# Altium schematic sheet RP2350A.SchDoc
size B; SheetNumber: 1; SheetTotal: 2
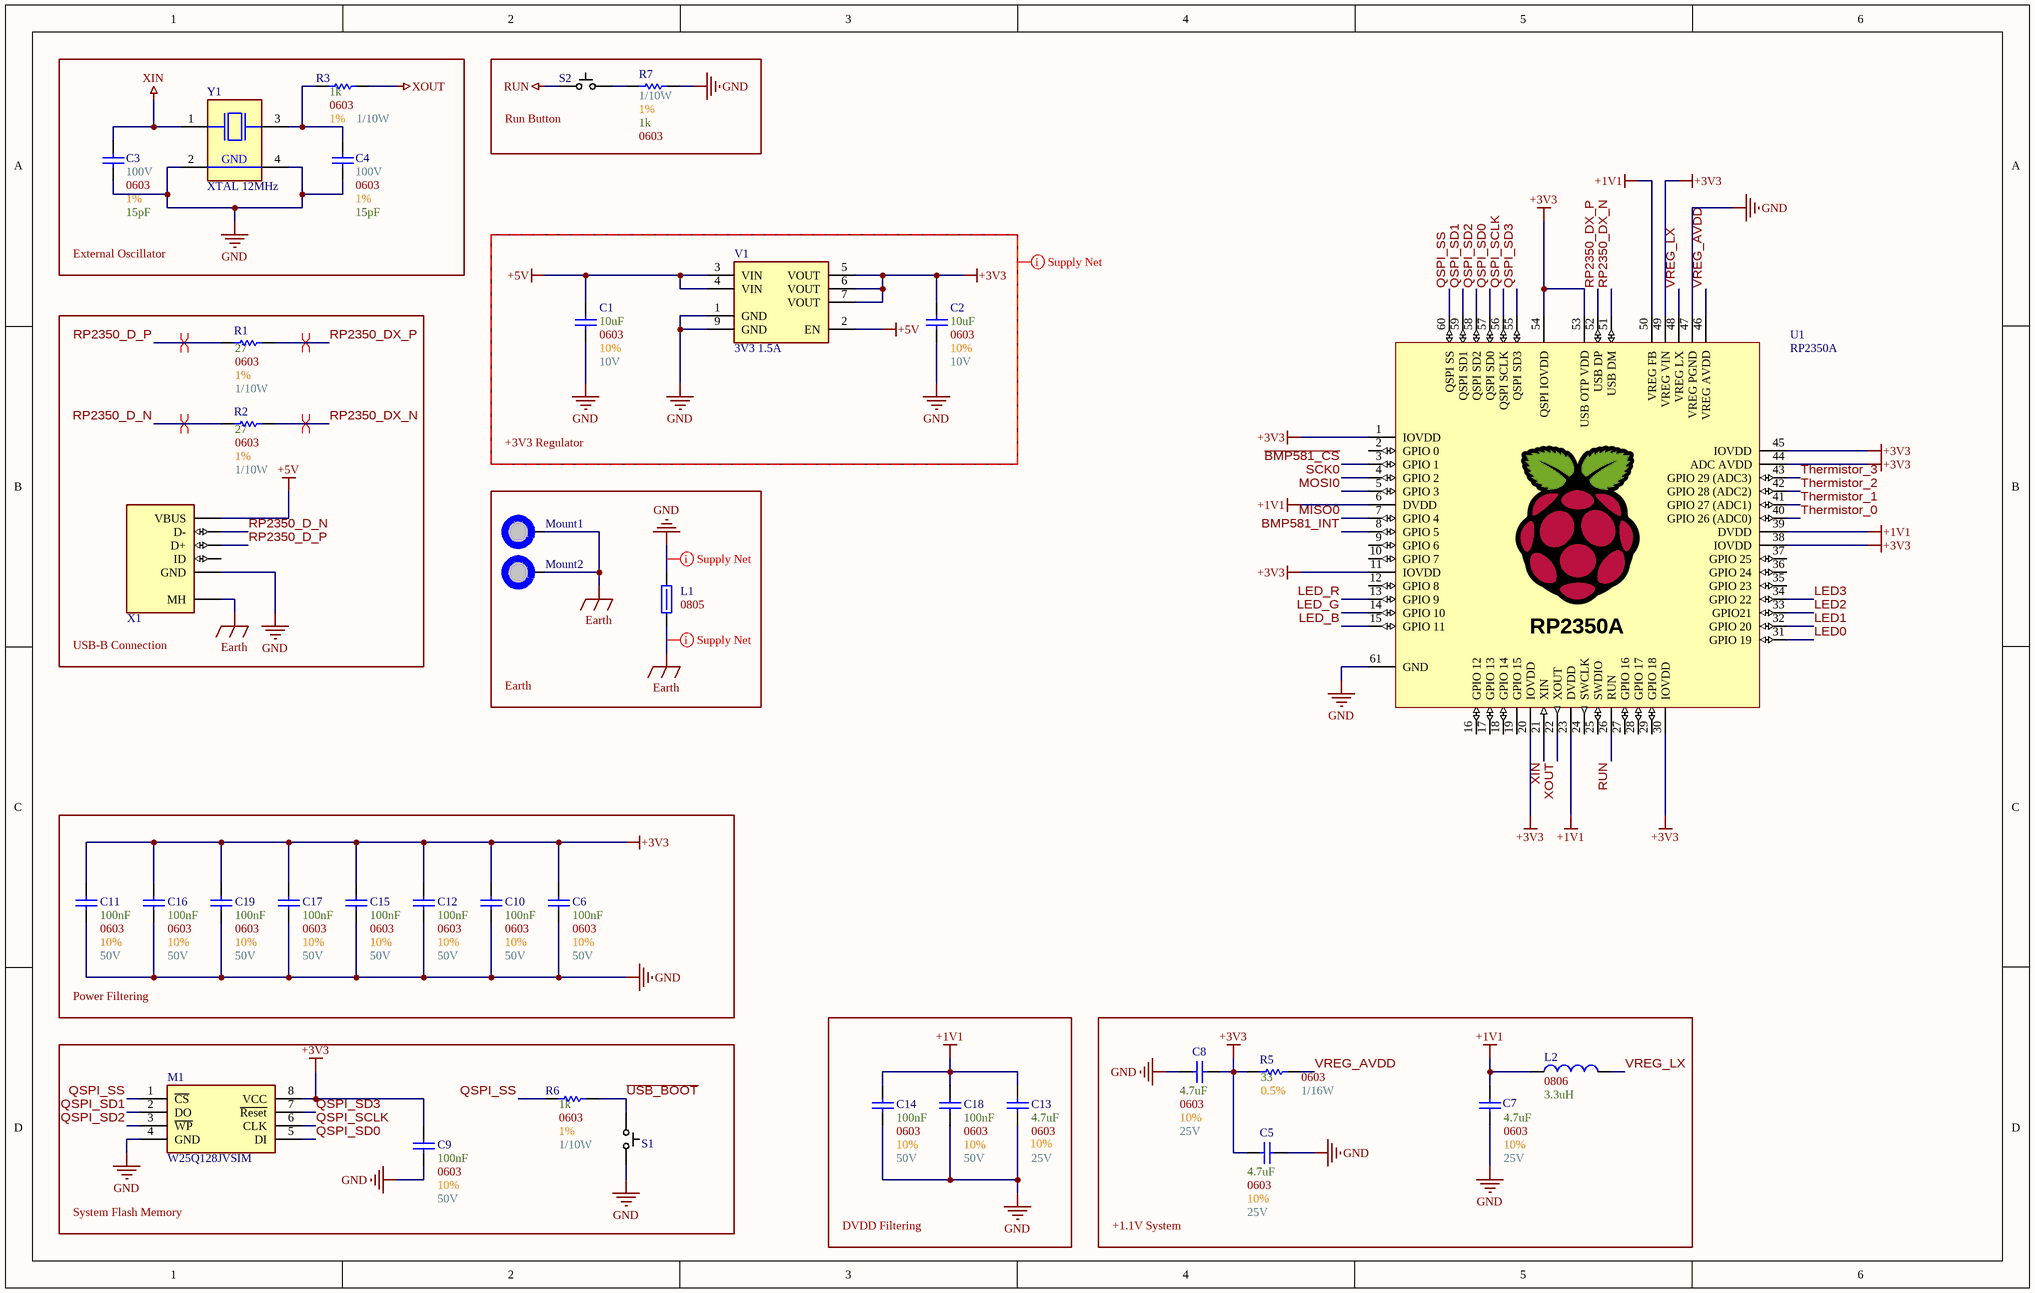
[diagram p0: RP2350A.SchDoc]

## Parts
C1  Max Voltage: 10V  Size Package: 0603  Tolerance: 10%  Capacitance: 10uF  [[Cap] SMD 0603]  (hidden comment: [Cap] 0603 10uF 10% 10V)
C2  Max Voltage: 10V  Size Package: 0603  Tolerance: 10%  Capacitance: 10uF  [[Cap] SMD 0603]  (hidden comment: [Cap] 0603 10uF 10% 10V)
C3  Max Voltage: 100V  Size Package: 0603  Tolerance: 1%  Capacitance: 15pF  [[Cap] SMD 0603]  (hidden comment: [Cap] 0603 15pF 1% 100V)
C4  Max Voltage: 100V  Size Package: 0603  Tolerance: 1%  Capacitance: 15pF  [[Cap] SMD 0603]  (hidden comment: [Cap] 0603 15pF 1% 100V)
C5  Max Voltage: 25V  Size Package: 0603  Tolerance: 10%  Capacitance: 4.7uF  [[Cap] SMD 0603]  (hidden comment: [Cap] 0603 4.7uF 10% 25V)
C6  Max Voltage: 50V  Size Package: 0603  Tolerance: 10%  Capacitance: 100nF  [[Cap] SMD 0603]  (hidden comment: [Cap] 0603 0.1uF 10% 50V)
C7  Max Voltage: 25V  Size Package: 0603  Tolerance: 10%  Capacitance: 4.7uF  [[Cap] SMD 0603]  (hidden comment: [Cap] 0603 4.7uF 10% 25V)
C8  Max Voltage: 25V  Size Package: 0603  Tolerance: 10%  Capacitance: 4.7uF  [[Cap] SMD 0603]  (hidden comment: [Cap] 0603 4.7uF 10% 25V)
C9  Max Voltage: 50V  Size Package: 0603  Tolerance: 10%  Capacitance: 100nF  [[Cap] SMD 0603]  (hidden comment: [Cap] 0603 0.1uF 10% 50V)
C10  Max Voltage: 50V  Size Package: 0603  Tolerance: 10%  Capacitance: 100nF  [[Cap] SMD 0603]  (hidden comment: [Cap] 0603 0.1uF 10% 50V)
C11  Max Voltage: 50V  Size Package: 0603  Tolerance: 10%  Capacitance: 100nF  [[Cap] SMD 0603]  (hidden comment: [Cap] 0603 0.1uF 10% 50V)
C12  Max Voltage: 50V  Size Package: 0603  Tolerance: 10%  Capacitance: 100nF  [[Cap] SMD 0603]  (hidden comment: [Cap] 0603 0.1uF 10% 50V)
C13  Max Voltage: 25V  Size Package: 0603  Tolerance: 10%  Capacitance: 4.7uF  [[Cap] SMD 0603]  (hidden comment: [Cap] 0603 4.7uF 10% 25V)
C14  Max Voltage: 50V  Size Package: 0603  Tolerance: 10%  Capacitance: 100nF  [[Cap] SMD 0603]  (hidden comment: [Cap] 0603 0.1uF 10% 50V)
C15  Max Voltage: 50V  Size Package: 0603  Tolerance: 10%  Capacitance: 100nF  [[Cap] SMD 0603]  (hidden comment: [Cap] 0603 0.1uF 10% 50V)
C16  Max Voltage: 50V  Size Package: 0603  Tolerance: 10%  Capacitance: 100nF  [[Cap] SMD 0603]  (hidden comment: [Cap] 0603 0.1uF 10% 50V)
C17  Max Voltage: 50V  Size Package: 0603  Tolerance: 10%  Capacitance: 100nF  [[Cap] SMD 0603]  (hidden comment: [Cap] 0603 0.1uF 10% 50V)
C18  Max Voltage: 50V  Size Package: 0603  Tolerance: 10%  Capacitance: 100nF  [[Cap] SMD 0603]  (hidden comment: [Cap] 0603 0.1uF 10% 50V)
C19  Max Voltage: 50V  Size Package: 0603  Tolerance: 10%  Capacitance: 100nF  [[Cap] SMD 0603]  (hidden comment: [Cap] 0603 0.1uF 10% 50V)
L1  Size Package: 0805  [[Ferrite] SMD 0805]  (hidden comment: 652-MH2029-300Y)
L2  Package: 0806  Inductance: 3.3uH  [[Inductor] SMD 0806]  (hidden comment: [3.3uH] SMD 0806 2.1A)
M1  W25Q128JVSIM  [[Flash] 128MBit]
Mount1  M3 Mount Hole  [[Mount] M3 Mount Hole]  (value not drawn)  (no BOM)
Mount2  M3 Mount Hole  [[Mount] M3 Mount Hole]  (value not drawn)  (no BOM)
R1  Wattage: 1/10W  Tolerance: 1%  Resistance: 27  Size Package: 0603  [[Res] SMD 0603]  (hidden comment: [27] SMD 0603 1% 1/10W)
R2  Wattage: 1/10W  Tolerance: 1%  Resistance: 27  Size Package: 0603  [[Res] SMD 0603]  (hidden comment: [27] SMD 0603 1% 1/10W)
R3  Wattage: 1/10W  Tolerance: 1%  Resistance: 1k  Size Package: 0603  [[Res] SMD 0603]  (hidden comment: [1k] SMD 0603 1% 1/10W)
R5  Wattage: 1/16W  Tolerance: 0.5%  Resistance: 33  Size Package: 0603  [[Res] SMD 0603]  (hidden comment: [33] SMD 0603 0.5% 1/16W)
R6  Wattage: 1/10W  Tolerance: 1%  Resistance: 1k  Size Package: 0603  [[Res] SMD 0603]  (hidden comment: [1k] SMD 0603 1% 1/10W)
R7  Wattage: 1/10W  Tolerance: 1%  Resistance: 1k  Size Package: 0603  [[Res] SMD 0603]  (hidden comment: [1k] SMD 0603 1% 1/10W)
S1  [SPST] SMD Pushbutton  [[SPST] SMD Pushbutton]  (value not drawn)
S2  [SPST] SMD Pushbutton  [[SPST] SMD Pushbutton]  (value not drawn)
U1  RP2350A  [[MCU] RP2350A]
V1  3V3 1.5A  [[Linear] 3V3 1.5A]
X1  [USB] Type-B Mini  [[USB] Type-B Mini]  (value not drawn)
Y1  XTAL 12MHz  [[Crystal] SMD 12MHz]

## Blocks framed on the sheet
External Oscillator: C3 C4 R3 Y1
Run Button: R7 S2
+3V3 Regulator: C1 C2 V1
USB-B Connection: R1 R2 X1
Earth: L1 Mount1 Mount2
Power Filtering: C6 C10-C12 C15-C17 C19
DVDD Filtering: C13 C14 C18
+1.1V System: C5 C7 C8 L2 R5
System Flash Memory: C9 M1 R6 S1

## Nets
+1V1: C7.1 C13.2 C14.2 C18.2 L2.1 U1.6(DVDD) U1.23(DVDD) U1.39(DVDD) U1.50(VREG_FB)
+3V3: C2.2 C5.2 C6.2 C8.1 C9.2 C10.2 C11.2 C12.2 C15.2 C16.2 C17.2 C19.2 M1.8(VCC) R5.1 U1.1(IOVDD) U1.11(IOVDD) U1.20(IOVDD) U1.30(IOVDD) U1.38(IOVDD) U1.44(ADC_AVDD) U1.45(IOVDD) U1.49(VREG_VIN) U1.53(USB_OTP_VDD) U1.54(QSPI_IOVDD) V1.5(VOUT) V1.6(VOUT) V1.7(VOUT)
+5V: C1.2 V1.2(EN) V1.3(VIN) V1.4(VIN) X1.1(VBUS)
Earth: L1.1 Mount1.1 Mount2.1 X1.MH
GND: C1.1 C2.1 C3.1 C4.1 C5.1 C6.1 C7.2 C8.2 C9.1 C10.1 C11.1 C12.1 C13.1 C14.1 C15.1 C16.1 C17.1 C18.1 C19.1 L1.2 M1.4(GND) R7.1 S1.2 U1.47(VREG_PGND) U1.61(GND) V1.1(GND) V1.9(GND) X1.5(GND) Y1.2(GND) Y1.4(GND)
RUN: S2.1 U1.26(RUN)
XIN: C3.2 U1.21(XIN) Y1.1(XTAL1)
XOUT: R3.2 U1.22(XOUT)
~{BMP581_CS}: U1.3(GPIO_1)
BMP581_INT: U1.8(GPIO_5)
LED0: U1.31(GPIO_19)
LED1: U1.32(GPIO_20)
LED2: U1.33(GPIO21)
LED3: U1.34(GPIO_22)
LED_B: U1.15(GPIO_11)
LED_G: U1.14(GPIO_10)
LED_R: U1.13(GPIO_9)
MISO0: U1.7(GPIO_4)
MOSI0: U1.5(GPIO_3)
QSPI_SCLK: M1.6(CLK) U1.56(QSPI_SCLK)
QSPI_SD0: M1.5(DI) U1.57(QSPI_SD0)
QSPI_SD1: M1.2(DO) U1.59(QSPI_SD1)
QSPI_SD2: M1.3(~{WP}) U1.58(QSPI_SD2)
QSPI_SD3: M1.7(~{Reset}) U1.55(QSPI_SD3)
QSPI_SS: M1.1(~{CS}) R6.1 U1.60(QSPI_SS)
RP2350_D_N: R2.1 X1.2(D-)
RP2350_D_P: R1.1 X1.3(D+)
RP2350_DX_N: R2.2 U1.51(USB_DM)
RP2350_DX_P: R1.2 U1.52(USB_DP)
SCK0: U1.4(GPIO_2)
Thermistor_0: U1.40(GPIO_26_(ADC0))
Thermistor_1: U1.41(GPIO_27_(ADC1))
Thermistor_2: U1.42(GPIO_28_(ADC2))
Thermistor_3: U1.43(GPIO_29_(ADC3))
~{USB_BOOT}: R6.2 S1.1
VREG_AVDD: R5.2 U1.46(VREG_AVDD)
VREG_LX: L2.2 U1.48(VREG_LX)
NetC4_2: C4.2 R3.1 Y1.3(XTAL2)
NetR7_2: R7.2 S2.2

Not connected (* = marked no-connect by the designer): U1 2(GPIO_0) 9(GPIO_6) 10(GPIO_7) 12(GPIO_8) 16(GPIO_12) 17(GPIO_13) 18(GPIO_14) 19(GPIO_15) 24(SWCLK) 25(SWDIO) 27(GPIO_16) 28(GPIO_17) 29(GPIO_18) 35(GPIO_23) 36(GPIO_24) 37(GPIO_25); X1 4(ID)

## Layout directives
differential pair; differential pair class USB_Pairs: RP2350_D_N, RP2350_D_P, RP2350_DX_N, RP2350_DX_P
net class Supply_Nets: +3V3, +5V, Earth, GND

## Library data of the parts
C1 C2 = [Cap] 0603 10uF 10% 10V: CL10A106KP8NNNC; Supplier 1: DigiKey; Supplier Part Number 1: 1276-1192-6-ND
C3 C4 = [Cap] 0603 15pF 1% 100V: GCM1885C2A150FA16D; Supplier 1: DigiKey; Supplier Part Number 1: 490-16416-1-ND
C5 C7 C8 C13 = [Cap] 0603 4.7uF 10% 25V: GRM188R61E475KE11D; Supplier 1: DigiKey; Supplier Part Number 1: 490-7203-6-ND
C6 C9-C12 C14-C19 = [Cap] 0603 0.1uF 10% 50V: CL10B104KB8NNNC; Supplier 1: DigiKey; Supplier Part Number 1: 1276-1000-6-ND
L1 = [Ferrite] SMD 0805 3A 30ohm: Res @ Freq: 30 @ 100MHz; Supplier 1: DigiKey; Supplier Part Number 1: MH2029-300YCT-ND
L2 = [3.3uH] SMD 0806 2.1A: AOTA-B201610S3R3-101-T; Supplier 1: DigiKey; Supplier Part Number 1: 535-AOTA-B201610S3R3-101-TCT-ND
M1 = [Flash] 128MBit: Supplier 1: DigiKey; Supplier Part Number 1: W25Q128JVSIM-ND
Mount1 Mount2 = [Mount] M3 Mount Hole: Place at least 4.5mm from board edge. Plated.
R1 R2 = [27] SMD 0603 1% 1/10W: MCT06030C2709FP500; Supplier 1: DigiKey; Supplier Part Number 1: 749-1631-1-ND
R3 R6 R7 = [1k] SMD 0603 1% 1/10W: RMCF0603FT1K00; Supplier 1: DigiKey; Supplier Part Number 1: RMCF0603FT1K00DKR-ND
R5 = [33] SMD 0603 0.5% 1/16W: RR0816Q-330-D; Supplier 1: DigiKey; Supplier Part Number 1: RR08Q33DDKR-ND
S1 S2 = [SPST] SMD Pushbutton: PTS815SJM250SMTRLFS; Supplier 1: DigiKey; Supplier Part Number 1: CKN12215-6-ND
U1 = [MCU] RP2350A: QFN-60 Package; Supplier 1: DigiKey; Supplier Part Number 1: 2648-SC1509-A4CT-ND
V1 = [Linear] SMD 3V3 1.5A: AP7362A-33SP-13; Supplier 1: DigiKey; Supplier Part Number 1: AP7362A-33SP-13DICT-ND
X1 = [USB] Type-B Mini: MUSB-05-S-B-SM-A-K-TR; Supplier 1: DigiKey; Supplier Part Number 1: SAM14226CT-ND
Y1 = [Crystal] SMD 12MHz: 815-ABM8-272-T3; Supplier 1: DigiKey; Supplier Part Number 1: 535-ABM8-272-T3CT-ND